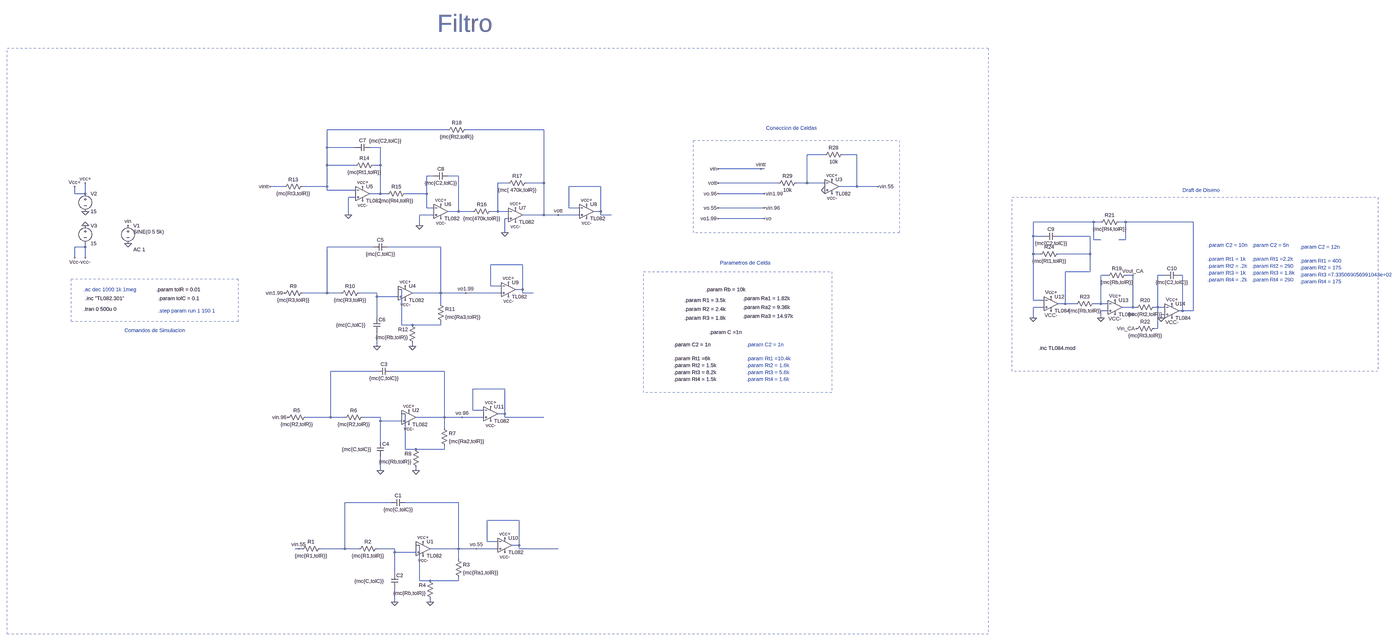
[diagram p0: schematic filterCelada.asc, whole sheet]
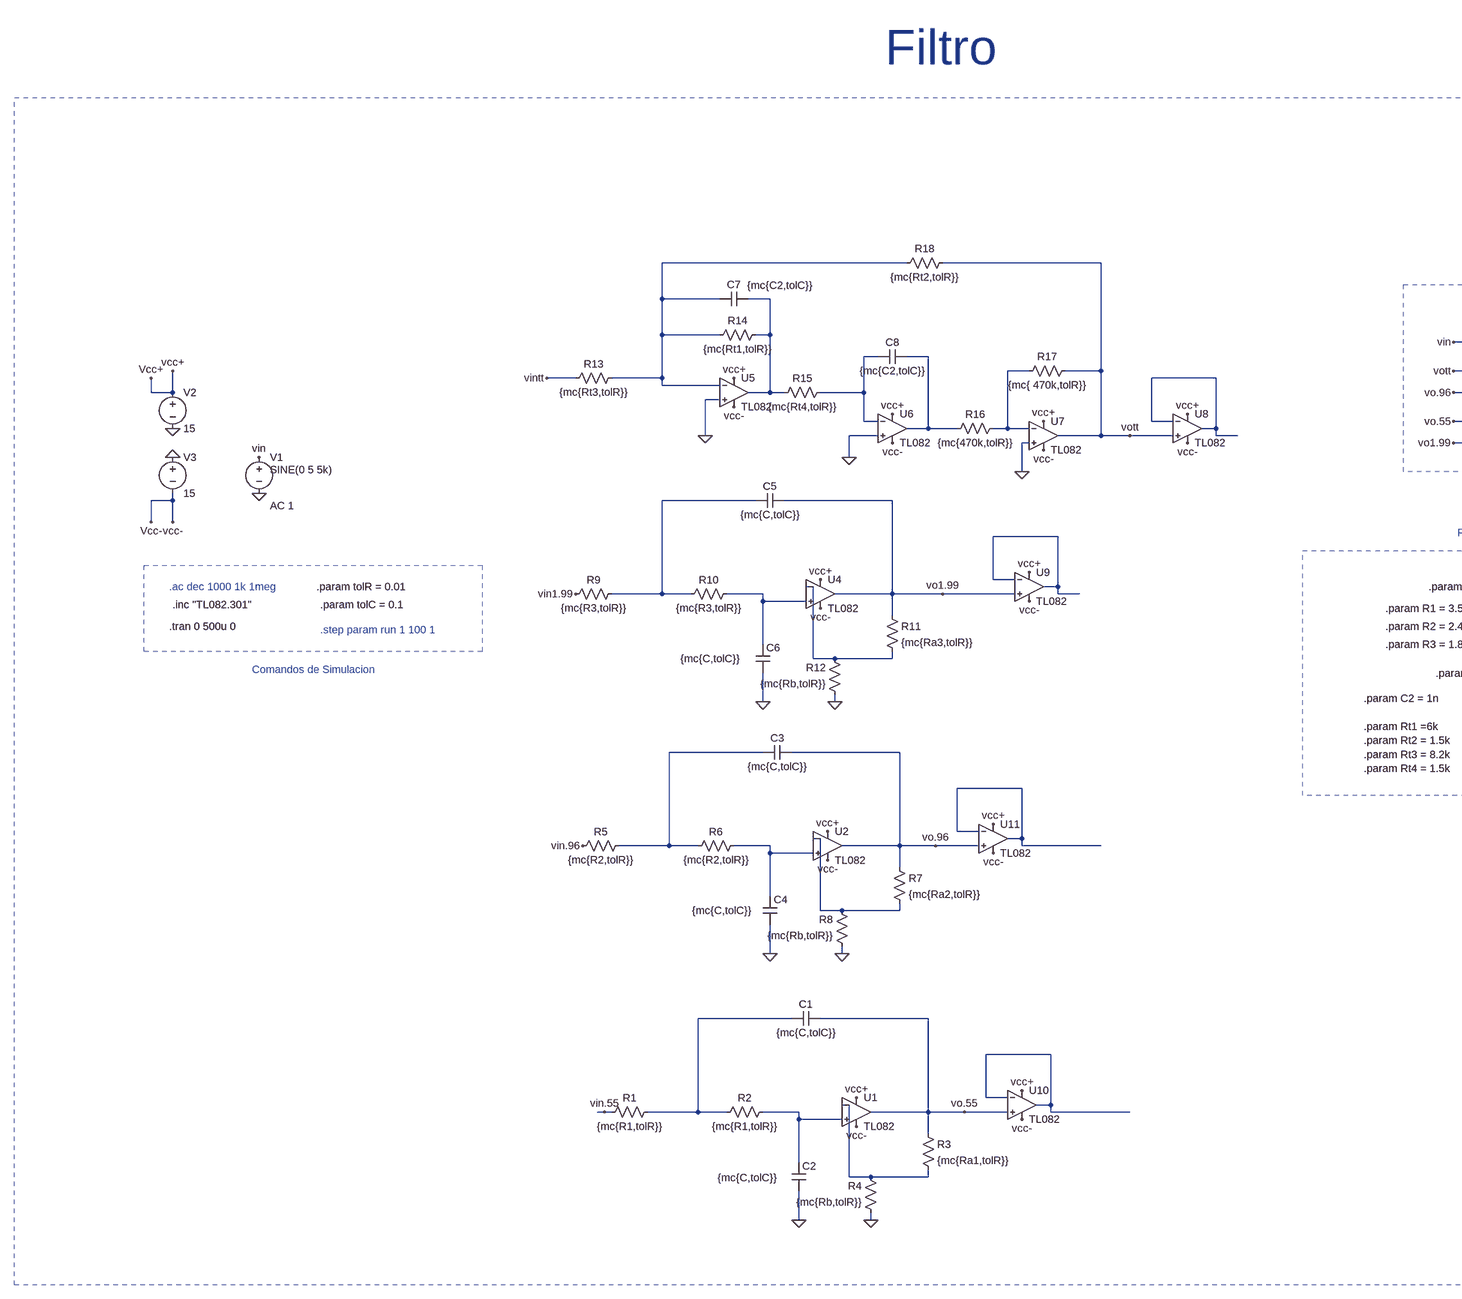
[diagram p1: schematic filterCelada.asc, part, row 1 of 1, column 1 of 2]
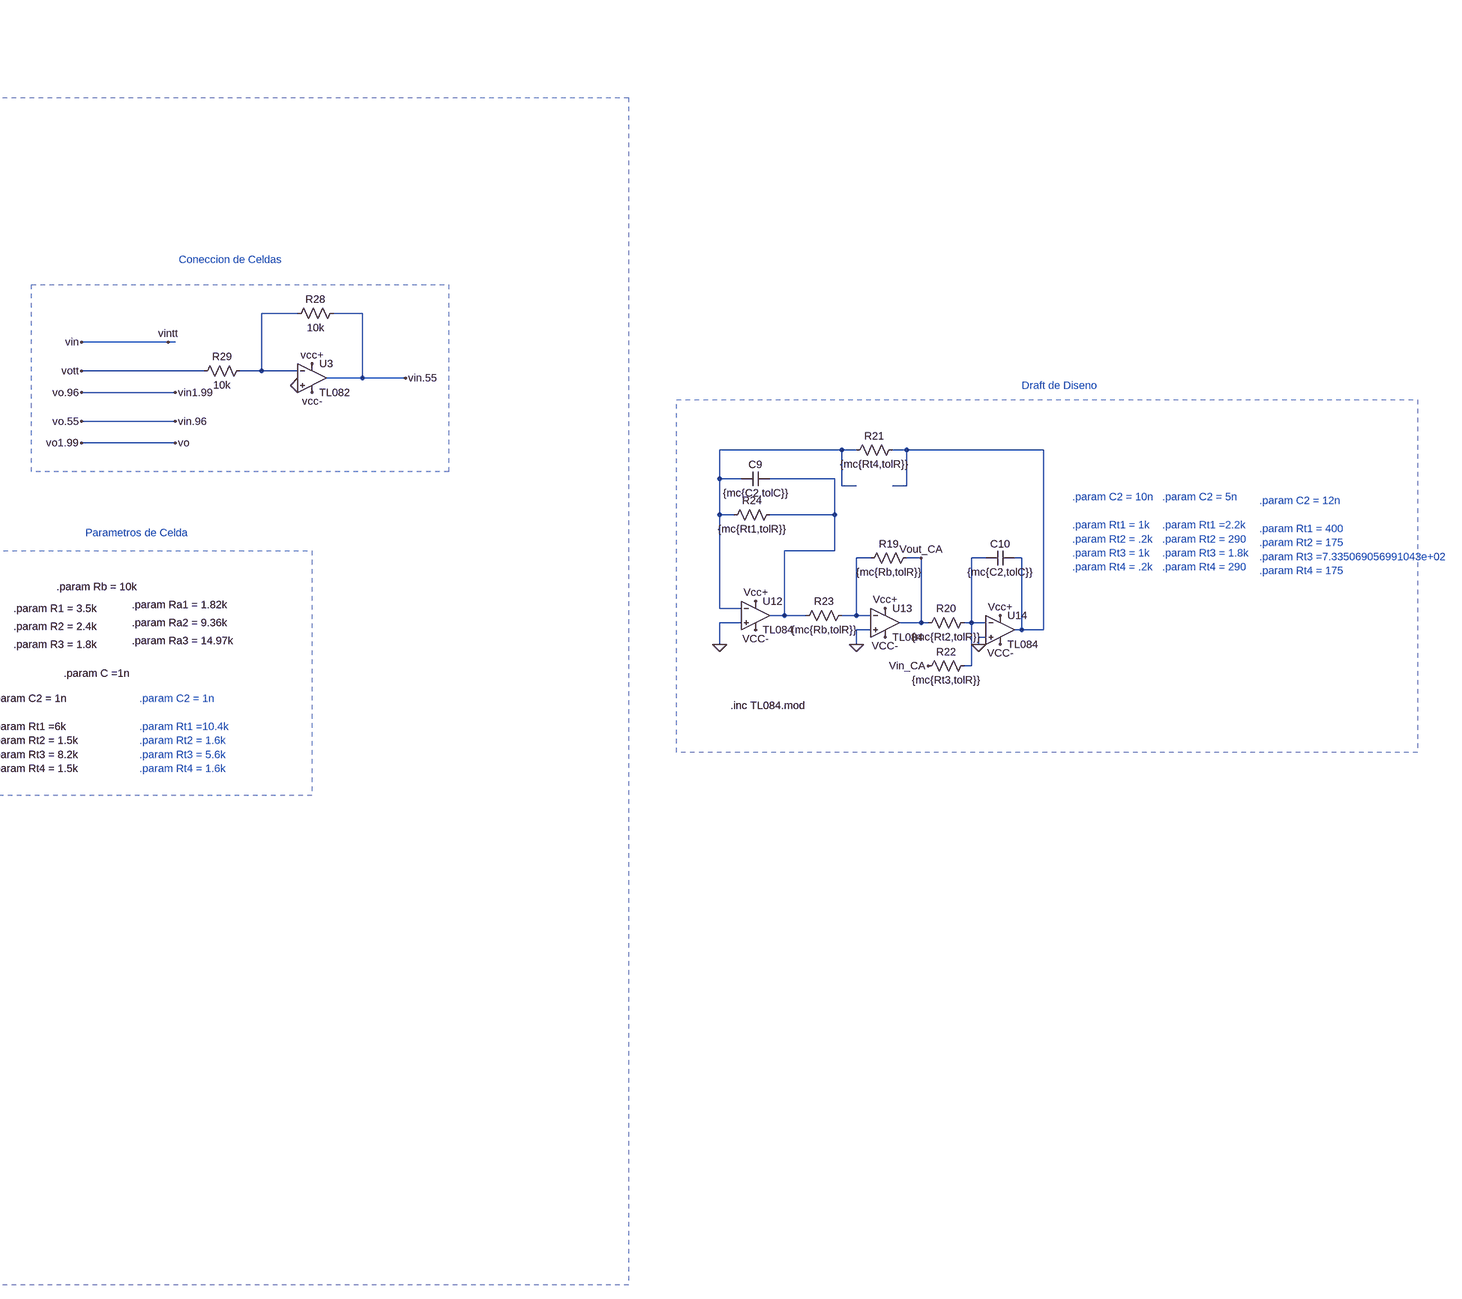
[diagram p2: schematic filterCelada.asc, part, row 1 of 1, column 2 of 2]
filterCelada.asc, the LTspice schematic file:
Version 4
SHEET 1 6028 2532
WIRE 1072 -224 528 -224
WIRE 1504 -224 1152 -224
WIRE 528 -144 528 -224
WIRE 656 -144 528 -144
WIRE 768 -144 720 -144
WIRE 2768 -112 2688 -112
WIRE 2912 -112 2848 -112
WIRE 528 -64 528 -144
WIRE 656 -64 528 -64
WIRE 768 -64 768 -144
WIRE 768 -64 736 -64
WIRE 2480 -48 2288 -48
WIRE 2496 -48 2480 -48
WIRE 1008 -16 976 -16
WIRE 1120 -16 1072 -16
WIRE 1344 16 1296 16
WIRE 1504 16 1504 -224
WIRE 1504 16 1424 16
WIRE 2560 16 2288 16
WIRE 2688 16 2688 -112
WIRE 2688 16 2640 16
WIRE 2768 16 2688 16
WIRE 336 32 272 32
WIRE 528 32 528 -64
WIRE 528 32 416 32
WIRE 1760 32 1616 32
WIRE 2912 32 2912 -112
WIRE 2912 32 2832 32
WIRE 3008 32 2912 32
WIRE 528 48 528 32
WIRE 656 48 528 48
WIRE -608 64 -608 32
WIRE -560 64 -560 16
WIRE -560 64 -608 64
WIRE 768 64 768 -64
WIRE 768 64 720 64
WIRE 800 64 768 64
WIRE 976 64 976 -16
WIRE 976 64 880 64
WIRE 2496 64 2288 64
WIRE 656 80 624 80
WIRE 976 128 976 64
WIRE 1008 128 976 128
WIRE 1616 128 1616 32
WIRE 1664 128 1616 128
WIRE 2496 128 2288 128
WIRE 1120 144 1120 -16
WIRE 1120 144 1072 144
WIRE 1184 144 1120 144
WIRE 1296 144 1296 16
WIRE 1296 144 1264 144
WIRE 1344 144 1296 144
WIRE 1760 144 1760 32
WIRE 1760 144 1728 144
WIRE 624 160 624 80
WIRE 1008 160 944 160
WIRE 1504 160 1504 16
WIRE 1504 160 1408 160
WIRE 1568 160 1504 160
WIRE 1664 160 1568 160
WIRE 1760 160 1760 144
WIRE 1808 160 1760 160
WIRE 1344 176 1328 176
WIRE 2496 176 2288 176
WIRE 4640 192 4368 192
WIRE 4672 192 4640 192
WIRE 4784 192 4752 192
WIRE 5088 192 4784 192
WIRE 944 208 944 160
WIRE 1328 240 1328 176
WIRE 4368 256 4368 192
WIRE 4416 256 4368 256
WIRE 4624 256 4480 256
WIRE 4640 272 4640 192
WIRE 4672 272 4640 272
WIRE 4784 272 4784 192
WIRE 4784 272 4752 272
WIRE -560 304 -560 288
WIRE -560 304 -608 304
WIRE 736 304 528 304
WIRE 1040 304 800 304
WIRE 4368 336 4368 256
WIRE 4400 336 4368 336
WIRE 4624 336 4624 256
WIRE 4624 336 4480 336
WIRE -608 352 -608 304
WIRE -560 352 -560 304
WIRE 1408 384 1264 384
WIRE 4624 416 4624 336
WIRE 4624 416 4512 416
WIRE 4704 432 4672 432
WIRE 4816 432 4784 432
WIRE 4960 432 4928 432
WIRE 5040 432 5024 432
WIRE 1264 480 1264 384
WIRE 1312 480 1264 480
WIRE 864 496 848 496
WIRE 1408 496 1408 384
WIRE 1408 496 1376 496
WIRE 528 512 528 304
WIRE 528 512 416 512
WIRE 592 512 528 512
WIRE 752 512 672 512
WIRE 1040 512 1040 304
WIRE 1040 512 912 512
WIRE 1152 512 1040 512
WIRE 1312 512 1152 512
WIRE 1408 512 1408 496
WIRE 1456 512 1408 512
WIRE 752 528 752 512
WIRE 848 528 752 528
WIRE 4368 544 4368 336
WIRE 4416 544 4368 544
WIRE 1040 560 1040 512
WIRE 4512 560 4512 416
WIRE 4512 560 4480 560
WIRE 4560 560 4512 560
WIRE 4672 560 4672 432
WIRE 4672 560 4640 560
WIRE 4704 560 4672 560
WIRE 4416 576 4368 576
WIRE 4816 576 4816 432
WIRE 4816 576 4768 576
WIRE 4832 576 4816 576
WIRE 4928 576 4928 432
WIRE 4928 576 4912 576
WIRE 4960 576 4928 576
WIRE 4704 592 4672 592
WIRE 5040 592 5040 432
WIRE 5040 592 5024 592
WIRE 5088 592 5088 192
WIRE 5088 592 5040 592
WIRE 4960 608 4944 608
WIRE 752 624 752 528
WIRE 4368 624 4368 576
WIRE 4672 624 4672 592
WIRE 4944 624 4944 608
WIRE 864 656 864 496
WIRE 912 656 864 656
WIRE 1040 656 1040 640
WIRE 1040 656 912 656
WIRE 4928 672 4928 576
WIRE 4928 672 4912 672
WIRE 752 752 752 688
WIRE 912 752 912 736
WIRE 752 864 544 864
WIRE 1056 864 816 864
WIRE 1328 944 1184 944
WIRE 1184 1040 1184 944
WIRE 1232 1040 1184 1040
WIRE 880 1056 864 1056
WIRE 1328 1056 1328 944
WIRE 1328 1056 1296 1056
WIRE 544 1072 544 864
WIRE 544 1072 432 1072
WIRE 608 1072 544 1072
WIRE 768 1072 688 1072
WIRE 1056 1072 1056 864
WIRE 1056 1072 928 1072
WIRE 1136 1072 1056 1072
WIRE 1232 1072 1136 1072
WIRE 1328 1072 1328 1056
WIRE 1504 1072 1328 1072
WIRE 768 1088 768 1072
WIRE 864 1088 768 1088
WIRE 1056 1120 1056 1072
WIRE 768 1184 768 1088
WIRE 880 1216 880 1056
WIRE 928 1216 880 1216
WIRE 1056 1216 1056 1200
WIRE 1056 1216 928 1216
WIRE 768 1312 768 1248
WIRE 928 1312 928 1296
WIRE 816 1456 608 1456
WIRE 1120 1456 880 1456
WIRE 1392 1536 1248 1536
WIRE 1248 1632 1248 1536
WIRE 1296 1632 1248 1632
WIRE 944 1648 928 1648
WIRE 1392 1648 1392 1536
WIRE 1392 1648 1360 1648
WIRE 400 1664 384 1664
WIRE 416 1664 400 1664
WIRE 608 1664 608 1456
WIRE 608 1664 496 1664
WIRE 672 1664 608 1664
WIRE 832 1664 752 1664
WIRE 1120 1664 1120 1456
WIRE 1120 1664 992 1664
WIRE 1200 1664 1120 1664
WIRE 1296 1664 1200 1664
WIRE 1392 1664 1392 1648
WIRE 1568 1664 1392 1664
WIRE 832 1680 832 1664
WIRE 928 1680 832 1680
WIRE 1120 1712 1120 1664
WIRE 832 1776 832 1680
WIRE 944 1808 944 1648
WIRE 992 1808 944 1808
WIRE 1120 1808 1120 1792
WIRE 1120 1808 992 1808
WIRE 832 1904 832 1840
WIRE 992 1904 992 1888
FLAG -368 288 0
FLAG -560 144 0
FLAG -560 208 0
FLAG -560 16 vcc+
FLAG -560 352 vcc-
FLAG -368 208 vin
FLAG 832 1904 0
FLAG 992 1904 0
FLAG 960 1632 vcc+
FLAG 960 1696 vcc-
FLAG 768 1312 0
FLAG 928 1312 0
FLAG 752 752 0
FLAG 912 752 0
FLAG 688 32 vcc+
FLAG 688 96 vcc-
FLAG 1040 112 vcc+
FLAG 1040 176 vcc-
FLAG 1376 128 vcc+
FLAG 1376 192 vcc-
FLAG 1152 512 vo1.99
FLAG 624 160 0
FLAG 944 208 0
FLAG 1328 240 0
FLAG 1344 464 vcc+
FLAG 1344 528 vcc-
FLAG 896 1040 vcc+
FLAG 896 1104 vcc-
FLAG 880 480 vcc+
FLAG 880 544 vcc-
FLAG 1696 112 vcc+
FLAG 1696 176 vcc-
FLAG 272 32 vintt
FLAG 1328 1616 vcc+
FLAG 1328 1680 vcc-
FLAG 1264 1024 vcc+
FLAG 1264 1088 vcc-
FLAG 1568 160 vott
FLAG 336 512 vin1.99
FLAG 352 1072 vin.96
FLAG 1136 1072 vo.96
FLAG 400 1664 vin.55
FLAG 1200 1664 vo.55
FLAG 2288 -48 vin
FLAG 2480 -48 vintt
FLAG 2288 16 vott
FLAG 2496 128 vin.96
FLAG 3008 32 vin.55
FLAG 2288 64 vo.96
FLAG 2496 64 vin1.99
FLAG 2288 128 vo.55
FLAG 2288 176 vo1.99
FLAG 2496 176 vo
FLAG 2800 0 vcc+
FLAG 2800 64 vcc-
FLAG 2768 48 0
FLAG 4368 624 0
FLAG 4672 624 0
FLAG 4944 624 0
FLAG 4992 560 Vcc+
FLAG 4736 544 Vcc+
FLAG 4448 528 Vcc+
FLAG 4992 624 VCC-
FLAG 4736 608 VCC-
FLAG 4448 592 VCC-
FLAG 4832 672 Vin_CA
FLAG 4816 432 Vout_CA
FLAG -608 32 Vcc+
FLAG -608 352 Vcc-
SYMBOL voltage -368 192 R0
WINDOW 123 24 124 Left 2
WINDOW 39 0 0 Left 2
WINDOW 3 24 44 Left 2
SYMATTR Value2 AC 1
SYMATTR Value SINE(0 5 5k)
SYMATTR InstName V1
SYMBOL voltage -560 48 R0
WINDOW 123 0 0 Left 0
WINDOW 39 0 0 Left 0
SYMATTR InstName V2
SYMATTR Value 15
SYMBOL voltage -560 192 R0
WINDOW 123 0 0 Left 0
WINDOW 39 0 0 Left 0
SYMATTR InstName V3
SYMATTR Value 15
SYMBOL res 512 1648 R90
WINDOW 0 0 56 VBottom 2
WINDOW 3 32 56 VTop 2
SYMATTR InstName R1
SYMATTR Value {mc{R1,tolR}}
SYMBOL res 768 1648 R90
WINDOW 0 0 56 VBottom 2
WINDOW 3 32 56 VTop 2
SYMATTR InstName R2
SYMATTR Value {mc{R1,tolR}}
SYMBOL Opamps\\opamp2 960 1600 R0
SYMATTR InstName U1
SYMATTR Value TL082
SYMBOL cap 880 1440 R90
WINDOW 0 0 32 VBottom 2
WINDOW 3 32 32 VTop 2
SYMATTR InstName C1
SYMATTR Value {mc{C,tolC}}
SYMBOL cap 816 1776 R0
WINDOW 3 -165 34 Left 2
SYMATTR Value {mc{C,tolC}}
SYMATTR InstName C2
SYMBOL res 1104 1696 R0
SYMATTR InstName R3
SYMATTR Value {mc{Ra1,tolR}}
SYMBOL res 1008 1904 R180
WINDOW 0 36 76 Left 2
WINDOW 3 36 40 Left 2
SYMATTR InstName R4
SYMATTR Value {mc{Rb,tolR}}
SYMBOL res 448 1056 R90
WINDOW 0 0 56 VBottom 2
WINDOW 3 32 56 VTop 2
SYMATTR InstName R5
SYMATTR Value {mc{R2,tolR}}
SYMBOL res 704 1056 R90
WINDOW 0 0 56 VBottom 2
WINDOW 3 32 56 VTop 2
SYMATTR InstName R6
SYMATTR Value {mc{R2,tolR}}
SYMBOL cap 816 848 R90
WINDOW 0 0 32 VBottom 2
WINDOW 3 32 32 VTop 2
SYMATTR InstName C3
SYMATTR Value {mc{C,tolC}}
SYMBOL cap 752 1184 R0
WINDOW 3 -157 32 Left 2
SYMATTR Value {mc{C,tolC}}
SYMATTR InstName C4
SYMBOL res 1040 1104 R0
SYMATTR InstName R7
SYMATTR Value {mc{Ra2,tolR}}
SYMBOL res 944 1312 R180
WINDOW 0 36 76 Left 2
WINDOW 3 36 40 Left 2
SYMATTR InstName R8
SYMATTR Value {mc{Rb,tolR}}
SYMBOL res 432 496 R90
WINDOW 0 0 56 VBottom 2
WINDOW 3 32 56 VTop 2
SYMATTR InstName R9
SYMATTR Value {mc{R3,tolR}}
SYMBOL res 688 496 R90
WINDOW 0 0 56 VBottom 2
WINDOW 3 32 56 VTop 2
SYMATTR InstName R10
SYMATTR Value {mc{R3,tolR}}
SYMBOL cap 800 288 R90
WINDOW 0 0 32 VBottom 2
WINDOW 3 32 32 VTop 2
SYMATTR InstName C5
SYMATTR Value {mc{C,tolC}}
SYMBOL cap 736 624 R0
WINDOW 3 -167 32 Left 2
SYMATTR Value {mc{C,tolC}}
SYMATTR InstName C6
SYMBOL res 1024 544 R0
SYMATTR InstName R11
SYMATTR Value {mc{Ra3,tolR}}
SYMBOL res 928 752 R180
WINDOW 0 36 76 Left 2
WINDOW 3 36 40 Left 2
SYMATTR InstName R12
SYMATTR Value {mc{Rb,tolR}}
SYMBOL Opamps\\opamp2 688 0 R0
SYMATTR InstName U5
SYMATTR Value TL082
SYMBOL Opamps\\opamp2 1040 80 R0
SYMATTR InstName U6
SYMATTR Value TL082
SYMBOL Opamps\\opamp2 1376 96 R0
SYMATTR InstName U7
SYMATTR Value TL082
SYMBOL res 432 16 R90
WINDOW 0 0 56 VBottom 2
WINDOW 3 32 56 VTop 2
SYMATTR InstName R13
SYMATTR Value {mc{Rt3,tolR}}
SYMBOL cap 720 -160 R90
WINDOW 0 0 32 VBottom 2
WINDOW 3 -30 -70 VTop 2
SYMATTR InstName C7
SYMATTR Value {mc{C2,tolC}}
SYMBOL cap 1072 -32 R90
WINDOW 0 0 32 VBottom 2
WINDOW 3 32 32 VTop 2
SYMATTR InstName C8
SYMATTR Value {mc{C2,tolC}}
SYMBOL res 752 -80 R90
WINDOW 0 0 56 VBottom 2
WINDOW 3 32 56 VTop 2
SYMATTR InstName R14
SYMATTR Value {mc{Rt1,tolR}}
SYMBOL res 896 48 R90
WINDOW 0 0 56 VBottom 2
WINDOW 3 32 56 VTop 2
SYMATTR InstName R15
SYMATTR Value {mc{Rt4,tolR}}
SYMBOL res 1280 128 R90
WINDOW 0 0 56 VBottom 2
WINDOW 3 32 56 VTop 2
SYMATTR InstName R16
SYMATTR Value {mc{470k,tolR}}
SYMBOL res 1440 0 R90
WINDOW 0 0 56 VBottom 2
WINDOW 3 32 56 VTop 2
SYMATTR InstName R17
SYMATTR Value {mc{ 470k,tolR}}
SYMBOL res 1168 -240 R90
WINDOW 0 0 56 VBottom 2
WINDOW 3 32 56 VTop 2
SYMATTR InstName R18
SYMATTR Value {mc{Rt2,tolR}}
SYMBOL Opamps\\opamp2 1344 432 R0
SYMATTR InstName U9
SYMATTR Value TL082
SYMBOL Opamps\\opamp2 896 1008 R0
SYMATTR InstName U2
SYMATTR Value TL082
SYMBOL Opamps\\opamp2 880 448 R0
SYMATTR InstName U4
SYMATTR Value TL082
SYMBOL Opamps\\opamp2 1696 80 R0
SYMATTR InstName U8
SYMATTR Value TL082
SYMBOL Opamps\\opamp2 1328 1584 R0
SYMATTR InstName U10
SYMATTR Value TL082
SYMBOL Opamps\\opamp2 1264 992 R0
SYMATTR InstName U11
SYMATTR Value TL082
SYMBOL Opamps\\opamp2 2800 -32 R0
SYMATTR InstName U3
SYMATTR Value TL082
SYMBOL res 2864 -128 R90
WINDOW 0 0 56 VBottom 2
WINDOW 3 32 56 VTop 2
SYMATTR InstName R28
SYMATTR Value 10k
SYMBOL res 2656 0 R90
WINDOW 0 0 56 VBottom 2
WINDOW 3 32 56 VTop 2
SYMATTR InstName R29
SYMATTR Value 10k
SYMBOL Opamps\\opamp2 4448 496 R0
SYMATTR InstName U12
SYMATTR Value TL084
SYMBOL Opamps\\opamp2 4736 512 R0
SYMATTR InstName U13
SYMATTR Value TL084
SYMBOL Opamps\\opamp2 4992 528 R0
SYMATTR InstName U14
SYMATTR Value TL084
SYMBOL cap 4480 240 R90
WINDOW 0 0 32 VBottom 2
WINDOW 3 32 32 VTop 2
SYMATTR InstName C9
SYMATTR Value {mc{C2,tolC}}
SYMBOL res 4800 416 R90
WINDOW 0 0 56 VBottom 2
WINDOW 3 32 56 VTop 2
SYMATTR InstName R19
SYMATTR Value {mc{Rb,tolR}}
SYMBOL res 4928 560 R90
WINDOW 0 0 56 VBottom 2
WINDOW 3 32 56 VTop 2
SYMATTR InstName R20
SYMATTR Value {mc{Rt2,tolR}}
SYMBOL cap 5024 416 R90
WINDOW 0 0 32 VBottom 2
WINDOW 3 32 32 VTop 2
SYMATTR InstName C10
SYMATTR Value {mc{C2,tolC}}
SYMBOL res 4768 176 R90
WINDOW 0 0 56 VBottom 2
WINDOW 3 32 56 VTop 2
SYMATTR InstName R21
SYMATTR Value {mc{Rt4,tolR}}
SYMBOL res 4928 656 R90
WINDOW 0 0 56 VBottom 2
WINDOW 3 32 56 VTop 2
SYMATTR InstName R22
SYMATTR Value {mc{Rt3,tolR}}
SYMBOL res 4656 544 R90
WINDOW 0 0 56 VBottom 2
WINDOW 3 32 56 VTop 2
SYMATTR InstName R23
SYMATTR Value {mc{Rb,tolR}}
SYMBOL res 4496 320 R90
WINDOW 0 0 56 VBottom 2
WINDOW 3 32 56 VTop 2
SYMATTR InstName R24
SYMATTR Value {mc{Rt1,tolR}}
TEXT -568 496 Left 2 ;.ac dec 1000 1k 1meg
TEXT -560 536 Left 2 !.inc "TL082.301"
TEXT 2232 496 Left 2 !.param Rb = 10k
TEXT 2136 544 Left 2 !.param R1 = 3.5k
TEXT 2400 536 Left 2 !.param Ra1 = 1.82k
TEXT 2136 584 Left 2 !.param R2 = 2.4k
TEXT 2400 576 Left 2 !.param Ra2 = 9.36k
TEXT 2136 624 Left 2 !.param R3 = 1.8k
TEXT 2400 616 Left 2 !.param Ra3 = 14.97k
TEXT 2248 688 Left 2 !.param C =1n
TEXT -240 496 Left 2 !.param tolR = 0.01
TEXT -232 536 Left 2 !.param tolC = 0.1
TEXT -232 592 Left 2 ;.step param run 1 100 1
TEXT 2416 744 Left 2 ;.param C2 = 1n\n \n.param Rt1 =10.4k\n.param Rt2 = 1.6k\n.param Rt3 = 5.6k\n.param Rt4 = 1.6k
TEXT 5352 296 Left 2 ;.param C2 = 5n\n \n.param Rt1 =2.2k\n.param Rt2 = 290\n.param Rt3 = 1.8k\n.param Rt4 = 290
TEXT 5568 304 Left 2 ;.param C2 = 12n\n \n.param Rt1 = 400\n.param Rt2 = 175\n.param Rt3 =7.335069056991043e+02\n.param Rt4 = 175
TEXT -568 584 Left 2 !.tran 0 500u 0
TEXT 5152 296 Left 2 ;.param C2 = 10n\n \n.param Rt1 = 1k\n.param Rt2 = .2k\n.param Rt3 = 1k\n.param Rt4 = .2k
TEXT 4392 760 Left 2 !.inc TL084.mod
TEXT 2088 744 Left 2 !.param C2 = 1n\n \n.param Rt1 =6k\n.param Rt2 = 1.5k\n.param Rt3 = 8.2k\n.param Rt4 = 1.5k
TEXT 2296 376 Left 2 ;Parametros de Celda
TEXT -384 680 Left 2 ;Comandos de Simulacion
TEXT 5040 48 Left 2 ;Draft de Diseno
TEXT 2504 -232 Left 2 ;Coneccion de Celdas
TEXT 1024 -704 Left 7 ;Filtro
RECTANGLE Normal 3504 2048 -912 -592 1
RECTANGLE Normal 2800 960 1952 416 1
RECTANGLE Normal 128 640 -624 448 1
RECTANGLE Normal 5920 864 4272 80 1
RECTANGLE Normal 3104 240 2176 -176 1

The netlist it stands for:
* filterCelada.asc
V1 vintt 0 SINE(0 5 5k) AC 1
V2 vcc+ 0 15
V3 0 vcc- 15
R1 N021 vin.55 {mc{R1,tolR}}
R2 N024 N021 {mc{R1,tolR}}
XU1 N024 N023 vcc+ vcc- vo.55 TL082  ; pins In+ In- V+ V- OUT
C1 vo.55 N021 {mc{C,tolC}}
C2 N024 0 {mc{C,tolC}}
R3 vo.55 N023 {mc{Ra1,tolR}}
R4 0 N023 {mc{Rb,tolR}}
R5 N017 vo.55 {mc{R2,tolR}}
R6 N020 N017 {mc{R2,tolR}}
C3 vo.96 N017 {mc{C,tolC}}
C4 N020 0 {mc{C,tolC}}
R7 vo.96 N019 {mc{Ra2,tolR}}
R8 0 N019 {mc{Rb,tolR}}
R9 N011 vo.96 {mc{R3,tolR}}
R10 N016 N011 {mc{R3,tolR}}
C5 vo N011 {mc{C,tolC}}
C6 N016 0 {mc{C,tolC}}
R11 vo N015 {mc{Ra3,tolR}}
R12 0 N015 {mc{Rb,tolR}}
XU5 0 N001 vcc+ vcc- N002 TL082  ; pins In+ In- V+ V- OUT
XU6 0 N004 vcc+ vcc- N005 TL082  ; pins In+ In- V+ V- OUT
XU7 0 N006 vcc+ vcc- vott TL082  ; pins In+ In- V+ V- OUT
R13 N001 vintt {mc{Rt3,tolR}}
C7 N002 N001 {mc{C2,tolC}}
C8 N005 N004 {mc{C2,tolC}}
R14 N002 N001 {mc{Rt1,tolR}}
R15 N004 N002 {mc{Rt4,tolR}}
R16 N006 N005 {mc{470k,tolR}}
R17 vott N006 {mc{ 470k,tolR}}
R18 vott N001 {mc{Rt2,tolR}}
XU9 vo N012 vcc+ vcc- N012 TL082  ; pins In+ In- V+ V- OUT
XU2 N020 N019 vcc+ vcc- vo.96 TL082  ; pins In+ In- V+ V- OUT
XU4 N016 N015 vcc+ vcc- vo TL082  ; pins In+ In- V+ V- OUT
XU8 vott N007 vcc+ vcc- N007 TL082  ; pins In+ In- V+ V- OUT
XU10 vo.55 N022 vcc+ vcc- N022 TL082  ; pins In+ In- V+ V- OUT
XU11 vo.96 N018 vcc+ vcc- N018 TL082  ; pins In+ In- V+ V- OUT
XU3 0 N003 vcc+ vcc- vin.55 TL082  ; pins In+ In- V+ V- OUT
R28 vin.55 N003 10k
R29 N003 vott 10k
XU12 0 N008 vcc+ vcc- N010 TL084  ; pins In+ In- V+ V- OUT
XU13 0 N013 vcc+ vcc- Vout_CA TL084  ; pins In+ In- V+ V- OUT
XU14 0 N014 vcc+ vcc- N009 TL084  ; pins In+ In- V+ V- OUT
C9 N010 N008 {mc{C2,tolC}}
R19 Vout_CA N013 {mc{Rb,tolR}}
R20 N014 Vout_CA {mc{Rt2,tolR}}
C10 N009 N014 {mc{C2,tolC}}
R21 N009 N008 {mc{Rt4,tolR}}
R22 N014 Vin_CA {mc{Rt3,tolR}}
R23 N013 N010 {mc{Rb,tolR}}
R24 N010 N008 {mc{Rt1,tolR}}
* .ac dec 1000 1k 1meg
.inc "TL082.301"
.param Rb = 10k
.param R1 = 3.5k
.param Ra1 = 1.82k
.param R2 = 2.4k
.param Ra2 = 9.36k
.param R3 = 1.8k
.param Ra3 = 14.97k
.param C =1n
.param tolR = 0.01
.param tolC = 0.1
* .step param run 1 100 1
* .param C2 = 1n
* .param Rt1 =10.4k
* .param Rt2 = 1.6k
* .param Rt3 = 5.6k
* .param Rt4 = 1.6k
* .param C2 = 5n
* .param Rt1 =2.2k
* .param Rt2 = 290
* .param Rt3 = 1.8k
* .param Rt4 = 290
* .param C2 = 12n
* .param Rt1 = 400
* .param Rt2 = 175
* .param Rt3 =7.335069056991043e+02
* .param Rt4 = 175
.tran 0 500u 0
* .param C2 = 10n
* .param Rt1 = 1k
* .param Rt2 = .2k
* .param Rt3 = 1k
* .param Rt4 = .2k
.inc TL084.mod
.param C2 = 1n
.param Rt1 =6k
.param Rt2 = 1.5k
.param Rt3 = 8.2k
.param Rt4 = 1.5k
* Parametros de Celda
* Comandos de Simulacion
* Draft de Diseno
* Coneccion de Celdas
* Filtro
.backanno
.end